# EAGLE design v1.receiver (EAGLE 6.4)
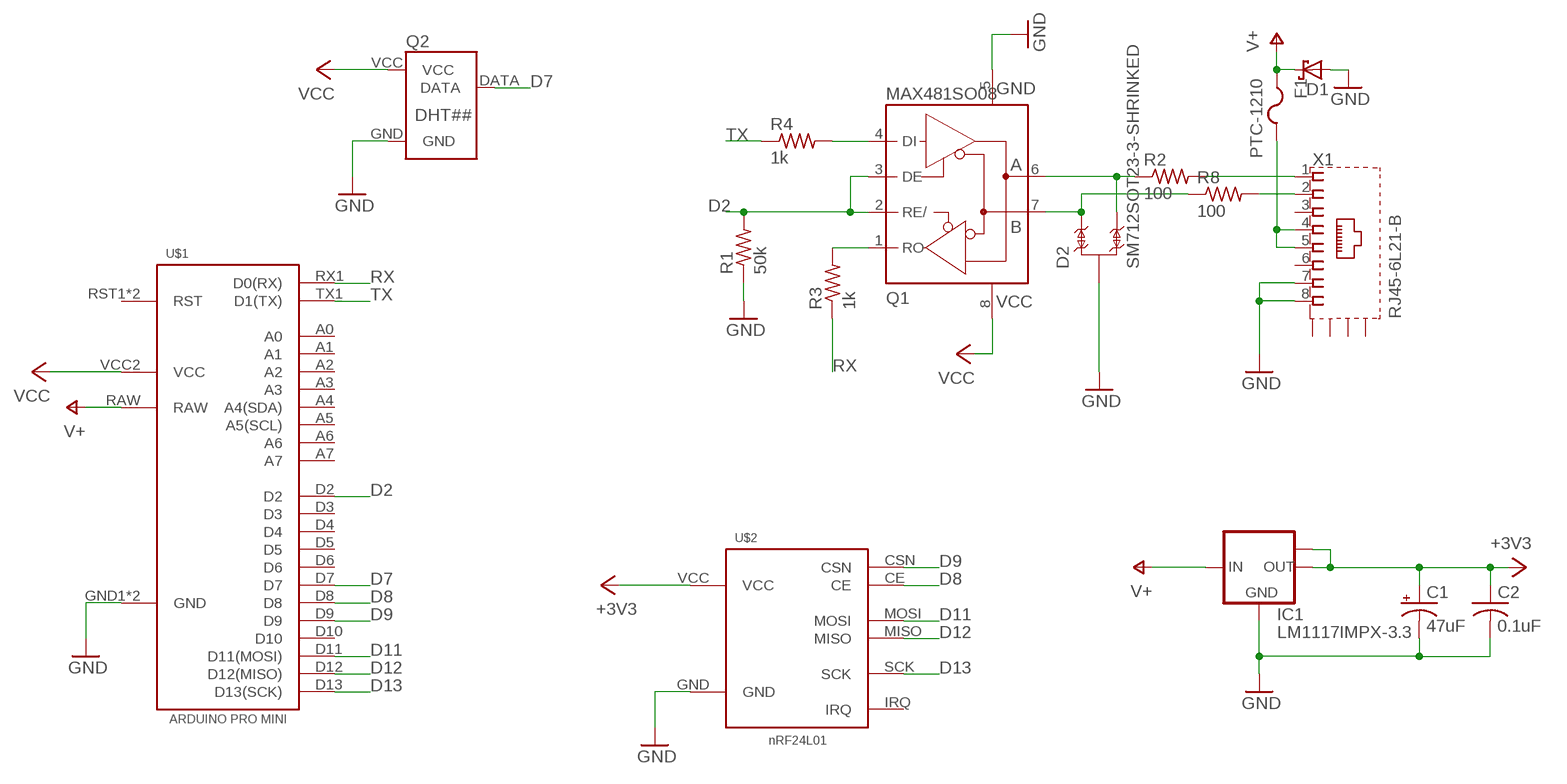
[diagram p0: schematic, sheet 1]

## Parts
C1  47uF  CPOL-USE2.5-5  [E2,5-5]
C2  0.1uF  C-USC0603  [C0603]
D1  SCHOTTKY-DIODESMC  [SMC]
D2  SM712SOT23-3-SHRINKED  [SOT23-3-SHRINKED]
F1  PTC-1210  [1210]
IC1  LM1117IMPX-3.3  [SOT223]
Q1  MAX481SO08  [SO08]
Q2  DHT##  [CONNECTOR-4-PIN-0.1]
R1  50k  R-US_R0603  [R0603]
R2  100  R-US_R0603  [R0603]
R3  1k  R-US_R0603  [R0603]
R4  1k  R-US_R0603  [R0603]
R8  100  R-US_R0603  [R0603]
U$1  ARDUINO-PRO-MININO-ICSP  [ARDUINO-PRO-MINI-NO-ICSP]
U$2  NRF24L01MODULE  [NRF24L01-MODULE]
X1  RJ45-6L21-B  [RJ45-SHIELD1]

## Nets
+3V3: C1.+ C2.1 IC1.2(OUT) IC1.TAB(OUT1) U$2.VCC
D2: Q1.2(RE/) Q1.3(DE) R1.2 U$1.D2
D7: Q2.DATA U$1.D7
D8: U$1.D8 U$2.CE
D9: U$1.D9 U$2.CSN
D11: U$1.D11(D11(MOSI)) U$2.MOSI
D12: U$1.D12(D12(MISO)) U$2.MISO
D13: U$1.D13(D13(SCK)) U$2.SCK
GND: C1.- C2.2 D1.A D2.3 IC1.1(GND) Q1.5(GND) Q2.GND R1.1 U$1.GND1(GND) U$1.GND4(GND) U$2.GND X1.7 X1.8
N$3: F1.2 X1.4 X1.5
N$4: D2.2 Q1.7(B) R8.1
N$5: Q1.1(RO) R3.2
N$6: Q1.4(DI) R4.2
N$7: R8.2 X1.2
N$8: R2.2 X1.1
N$9: D2.1 Q1.6(A) R2.1
RX: R3.1 U$1.RX1(D0(RX))
TX: R4.1 U$1.TX1(D1(TX))
V+: D1.C F1.1 IC1.3(IN) U$1.RAW
VCC: Q1.8(+5V) Q2.VCC U$1.VCC2(VCC)
Unconnected: U$1.A0 U$1.A1 U$1.A2 U$1.A3 U$1.A4(A4(SDA)) U$1.A5(A5(SCL)) U$1.A6 U$1.A7 U$1.D3 U$1.D4 U$1.D5 U$1.D6 U$1.D10 U$1.RST1(RST) U$1.RST2(RST) U$2.IRQ X1.3 X1.6 X1.S1(S) X1.S2(S) X1.S3(S) X1.S4(S)

## Library data of the parts
C1 = adafruit:CPOL-US: POLARIZED CAPACITOR, American symbol
C2 = adafruit:C-US: CAPACITOR, American symbol
D1 = diode:SCHOTTKY-DIODE: Schottky Diode
D2 = serge:SM712: SM712 Series 600W Asymmetrical TVS Diode Array; Datasheet: http://www.littelfuse.com/~/media/electronics/datasheets/tvs_diode_arrays/littelfuse_tvs_diode_array_sm712_datasheet.pdf.pdf
F1 = serge:PTC-1210
IC1 = lm1117:LM1117IMPX-*
Q1 = serge:MAX481
Q2 = serge:DHT##
R1-R4 R8 = adafruit:R-US_: RESISTOR, American symbol
U$1 = serge:ARDUINO-PRO-MINI
U$2 = serge:NRF24L01
X1 = con-tycoelectronics:RJ45*2: RJ45 Low Profile Shield Type 2 For all RJ45 L, LC, LCT and X Series Models Source: www.tycoelectronics.com .. ENG_DS_1654001_1099_RJ_L_0507.pdf; OC_FARNELL: unknown; OC_NEWARK: unknown

## Board
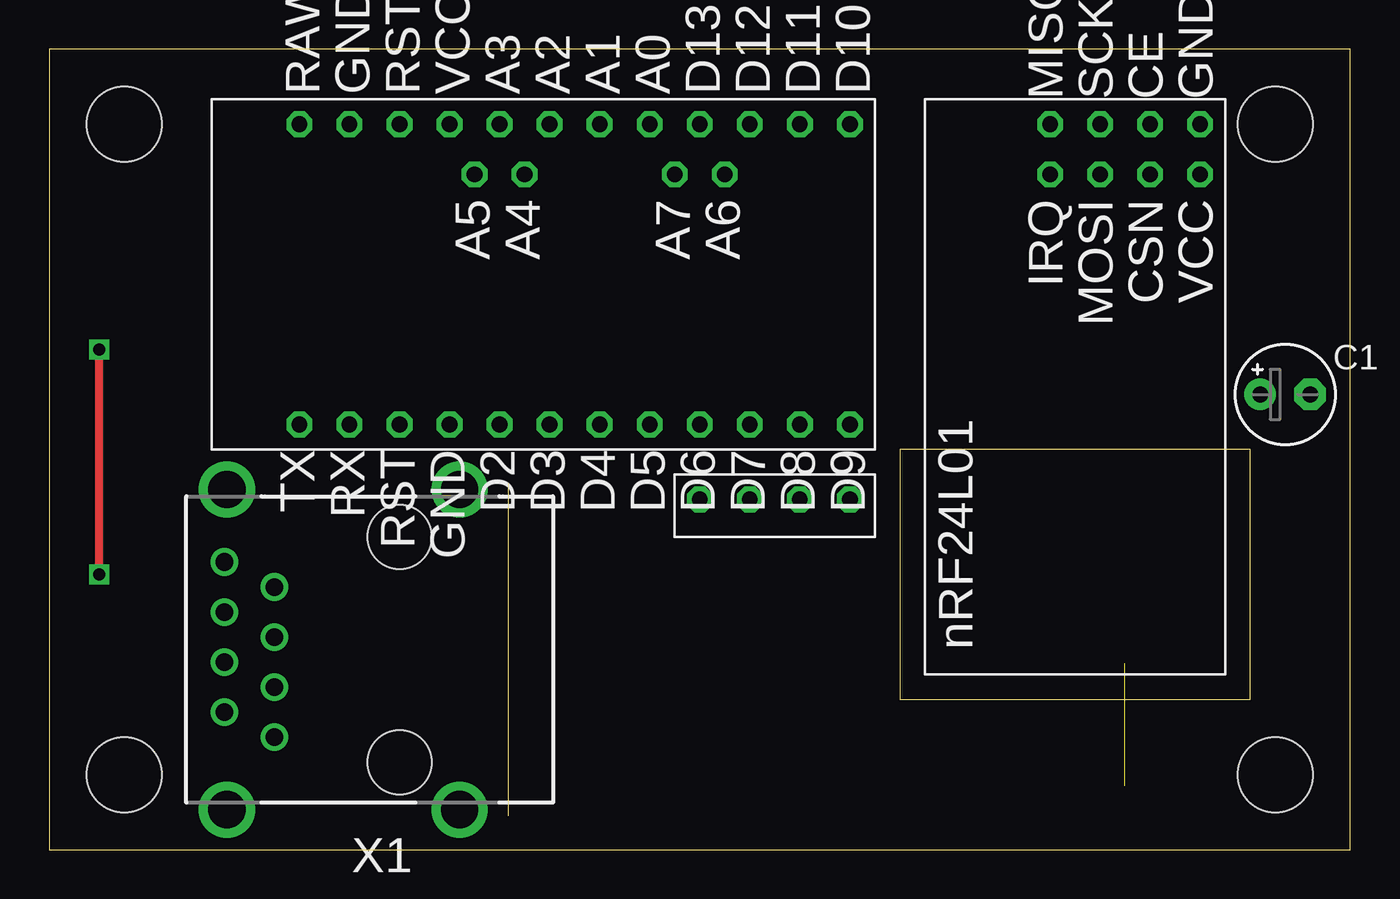
[diagram p1: board, top side]
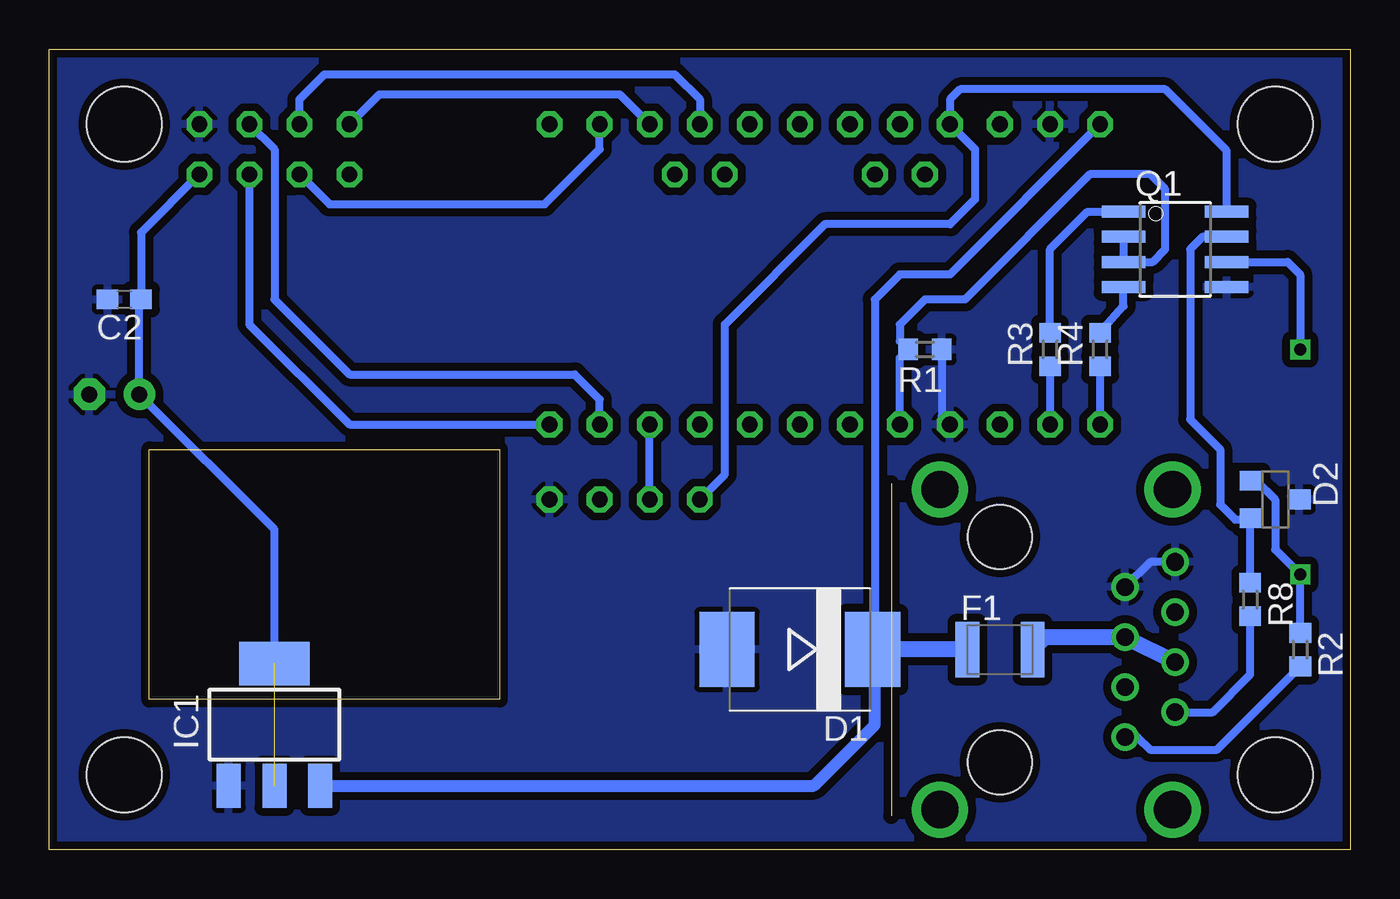
[diagram p2: board, bottom side, seen from below]

Size 66.04 x 40.64 mm. Coordinates in mm from the lower left corner, seen from the top.
Outline: 0,0 66.04,0 66.04,40.64 0,40.64 0,0
Copper layers (1*16): Top 0.035mm / dielectric 1.5mm / Bottom 0.035mm
Design rules "default": minimum track width 10mil, minimum drill 24mil, track to track 16mil, track to pad 16mil, pad to pad 16mil, via to via 16mil, smd to smd 16mil, copper to edge 16mil, drill to drill 8mil, minimum pad ring 10mil, minimum via ring 8mil, stop-mask expansion 4mil, vias tented up to drill 0mil, thermal gap 10mil
Holes 3.81 mm at 3.81,3.81 3.81,36.83 62.23,36.83 62.23,3.81

### Footprints (pad centres in the part's own frame; a part is rotated, then mirrored left to right if it is on the bottom)
E2,5-5 = drill 0.813 pad 1.6: + -1.27,0 | drill 0.813 pad 1.6 octagon: - 1.27,0
C0603 = smd 1.1 x 1: 1 -0.85,0; 2 0.85,0
SMC = smd 2.8 x 3.8: A 3.7,0; C -3.7,0
SOT23-3-SHRINKED = smd 1 x 1.146: 1 -0.95,-1.227; 2 0.95,-1.227; 3 0,1.227
1210 = smd 1.2 x 2.8: 1 -1.65,0; 2 1.65,0
SOT223 = smd 1.219 x 2.235: 1 -2.311,-3.099; 2 0,-3.099; 3 2.311,-3.099 | smd 3.6 x 2.2: TAB 0,3.099
SO08 = smd 0.61 x 2.21: 1 -1.905,-2.616; 2 -0.635,-2.616; 3 0.635,-2.616; 4 1.905,-2.616; 5 1.905,2.616; 6 0.635,2.616; 7 -0.635,2.616; 8 -1.905,2.616
CONNECTOR-4-PIN-0.1 = drill 0.8 octagon: DATA -1.27,0; GND 3.81,0; N/C 1.27,0; VCC -3.81,0
R0603 = smd 1 x 1.1: 1 -0.85,0; 2 0.85,0
ARDUINO-PRO-MINI-NO-ICSP = drill 0.8 octagon: A0 -3.81,-7.62; A1 -1.27,-7.62; A2 1.27,-7.62; A3 3.81,-7.62; A4 2.54,-5.08; A5 5.08,-5.08; A6 -7.62,-5.08; A7 -5.08,-5.08; D2 3.81,7.62; D3 1.27,7.62; D4 -1.27,7.62; D5 -3.81,7.62; D6 -6.35,7.62; D7 -8.89,7.62; D8 -11.43,7.62; D9 -13.97,7.62; D10 -13.97,-7.62; D11 -11.43,-7.62; D12 -8.89,-7.62; D13 -6.35,-7.62; GND1 11.43,-7.62; GND4 6.35,7.62; RAW 13.97,-7.62; RST1 8.89,7.62; RST2 8.89,-7.62; RX1 11.43,7.62; TX1 13.97,7.62; VCC2 6.35,-7.62
NRF24L01-MODULE = drill 0.8 octagon: CE 10.16,-2.54; CSN 7.62,-2.54; GND 10.16,-5.08; IRQ 7.62,2.54; MISO 10.16,2.54; MOSI 7.62,0; SCK 10.16,0; VCC 7.62,-5.08
RJ45-SHIELD1 = drill 0.9 pad 1.4: 1 -4.445,6.35; 2 -3.175,8.89; 3 -1.905,6.35; 4 -0.635,8.89; 5 0.635,6.35; 6 1.905,8.89; 7 3.175,6.35; 8 4.445,8.89 | drill 1.9 pad 2.5: S1 -8.128,-3.048; S2 8.128,-3.048; S3 -8.128,8.76; S4 8.128,8.76 | hole 3.251: -5.715,0; 5.715,0

### Placement (x,y rotation side)
C1  62.74,23.11 0 top
C2  62.23,27.94 180 bottom
D1  27.94,10.16 180 bottom
D2  3.81,17.78 270 bottom
F1  17.78,10.16 0 bottom
IC1  54.61,6.35 0 bottom
Q1  8.89,30.48 270 bottom
Q2  36.83,17.78 0 top
R1  21.59,25.4 180 bottom
R2  2.54,10.16 270 bottom
R3  15.24,25.4 90 bottom
R4  12.7,25.4 90 bottom
R8  5.08,12.7 270 bottom
U$1  26.67,29.21 180 top
U$2  53.34,26.67 90 top
X1  17.78,10.16 90 top

### Tracks (layer width: path | path; a pad name or v marks a point on that pad's centre or on a via)
+3V3  (1 unrouted)
  Bottom 0.406: U$2.VCC 61.38,31.33 C2.1 61.47,27.85 C1.+ 54.61,16.26 IC1.TAB
D2
  Bottom 0.406: Q1.2 Q1.3 10.03,29.84 9.4,30.48 9.4,33.53 10.16,34.29 13.21,34.29 19.56,27.94 21.59,27.94 22.86,26.67 22.86,25.82 R1.2 22.86,24.98 U$1.D2
D7
  Bottom 0.406: Q2.DATA U$1.D7
D8
  Bottom 0.406: U$2.CE 54.61,35.56 54.61,27.94 50.8,24.13 39.37,24.13 38.1,22.86 U$1.D8
D9
  Bottom 0.406: U$2.CSN 55.88,26.67 50.8,21.59 U$1.D9
D11
  Bottom 0.406: U$2.MOSI 51.82,32.77 40.89,32.77 38.1,35.56 U$1.D11
D12
  Bottom 0.406: U$2.MISO 49.28,38.35 37.08,38.35 U$1.D12
D13
  Bottom 0.406: U$2.SCK 53.34,38.1 52.07,39.37 34.29,39.37 33.02,38.1 U$1.D13
GND
  Bottom 0.406: X1.8 10.16,14.61 X1.7 | R1.1 20.74,22.01 U$1.GND4
  pour Bottom: 0,40.64 66.04,40.64 66.04,0 0,0
N$3
  Bottom 0.813: F1.2 15.49,10.79 X1.5 X1.4
N$4
  Bottom 0.406: R8.1 5.08,16.79 D2.2 5.1,16.76 5.84,16.76 6.6,17.53 6.6,20.32 8.13,21.84 8.13,30.48 7.49,31.11 Q1.7
N$5
  Bottom 0.406: R3.2 15.24,30.48 13.34,32.38 Q1.1
N$6
  Bottom 0.406: R4.2 11.51,27.6 Q1.4
N$7
  Bottom 0.406: X1.2 6.99,6.99 5.08,8.89 R8.2
N$8
  Bottom 0.406: X1.1 10.79,5.71 10.16,5.08 6.77,5.08 R2.2
N$9  (via drill 0.6)
  Top 0.406: v2.54,13.97 v2.54,25.4
  Bottom 0.406: R2.1 v2.54,13.97 3.81,15.24 3.81,17.78 4.76,18.73 D2.1 | Q1.6 3.17,29.84 2.54,29.21 v2.54,25.4
RX
  Bottom 0.406: R3.1 U$1.RX1
TX
  Bottom 0.406: R4.1 U$1.TX1
V+
  Bottom 0.406: U$1.RAW 20.32,29.21 22.86,29.21 24.13,27.94 24.13,11.43 24.24,11.32 D1.C
  Bottom 0.61: IC1.3 27.23,3.25 24.13,6.35 24.13,10.05 D1.C
  Bottom 0.813: F1.1 D1.C
VCC
  Bottom 0.406: Q1.8 6.27,35.48 9.4,38.61 19.81,38.61 20.32,38.1 U$1.VCC2 19.05,35.56 19.05,33.02 20.32,31.75 26.67,31.75 31.75,26.67 31.75,19.05 Q2.VCC